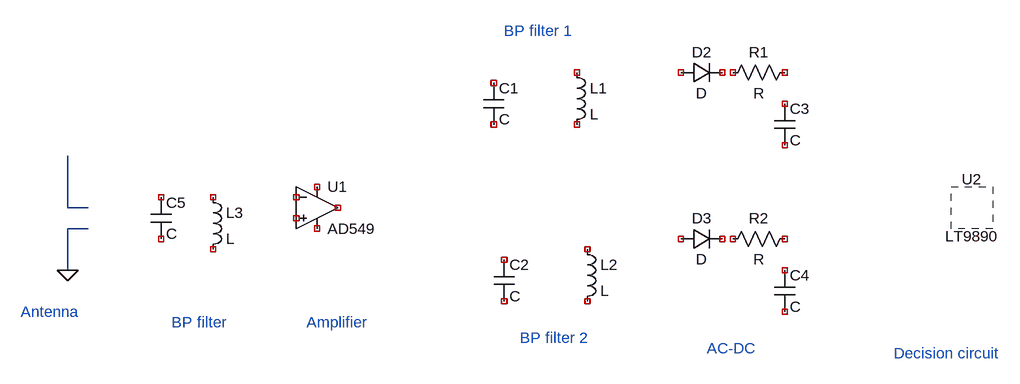
[diagram p0: schematic schematic-demod.asc]
schematic-demod.asc, the LTspice schematic file:
Version 4
SHEET 1 1560 680
WIRE -112 112 -112 32
WIRE -80 112 -112 112
WIRE -80 144 -112 144
WIRE -112 208 -112 144
FLAG -112 208 0
SYMBOL OpAmps\\AD549 272 48 R0
SYMATTR InstName U1
SYMBOL cap 528 -80 R0
SYMATTR InstName C1
SYMBOL cap 544 192 R0
SYMATTR InstName C2
SYMBOL ind 656 -112 R0
SYMATTR InstName L1
SYMBOL ind 672 160 R0
SYMATTR InstName L2
SYMBOL cap 976 -48 R0
SYMATTR InstName C3
SYMBOL diode 832 -80 R270
WINDOW 0 32 32 VTop 2
WINDOW 3 0 32 VBottom 2
SYMATTR InstName D2
SYMBOL res 896 -80 R270
WINDOW 0 32 56 VTop 2
WINDOW 3 0 56 VBottom 2
SYMATTR InstName R1
SYMBOL cap 976 208 R0
SYMATTR InstName C4
SYMBOL diode 832 176 R270
WINDOW 0 32 32 VTop 2
WINDOW 3 0 32 VBottom 2
SYMATTR InstName D3
SYMBOL res 896 176 R270
WINDOW 0 32 56 VTop 2
WINDOW 3 0 56 VBottom 2
SYMATTR InstName R2
SYMBOL CurrentMonitors\\LT9890 1280 112 R0
SYMATTR InstName U2
SYMBOL cap 16 96 R0
SYMATTR InstName C5
SYMBOL ind 96 80 R0
SYMATTR InstName L3
TEXT -184 272 Left 2 ;Antenna
TEXT 256 288 Left 2 ;Amplifier
TEXT 48 288 Left 2 ;BP filter
TEXT 560 -160 Left 2 ;BP filter 1
TEXT 584 312 Left 2 ;BP filter 2
TEXT 872 328 Left 2 ;AC-DC
TEXT 1160 336 Left 2 ;Decision circuit

The netlist it stands for:
* schematic-demod.asc
XU1 NC_01 NC_02 NC_03 NC_04 NC_05 AD549  ; pins In+ In- V+ V- OUT
C1 NC_06 NC_07 C
C2 NC_08 NC_09 C
L1 NC_10 NC_11 L
L2 NC_12 NC_13 L
C3 NC_14 NC_15 C
D2 NC_16 NC_17 D
R1 NC_18 NC_19 R
C4 NC_20 NC_21 C
D3 NC_22 NC_23 D
R2 NC_24 NC_25 R
* U2: LT9890 (symbol CurrentMonitors\LT9890 not available, pin order unknown); nets seen at it: 
C5 NC_26 NC_27 C
L3 NC_28 NC_29 L
.model D D
.lib standard.dio
* Antenna
* Amplifier
* BP filter
* BP filter 1
* BP filter 2
* AC-DC
* Decision circuit
.backanno
.end